# Altium project SCOPE_F07x.PrjPcb
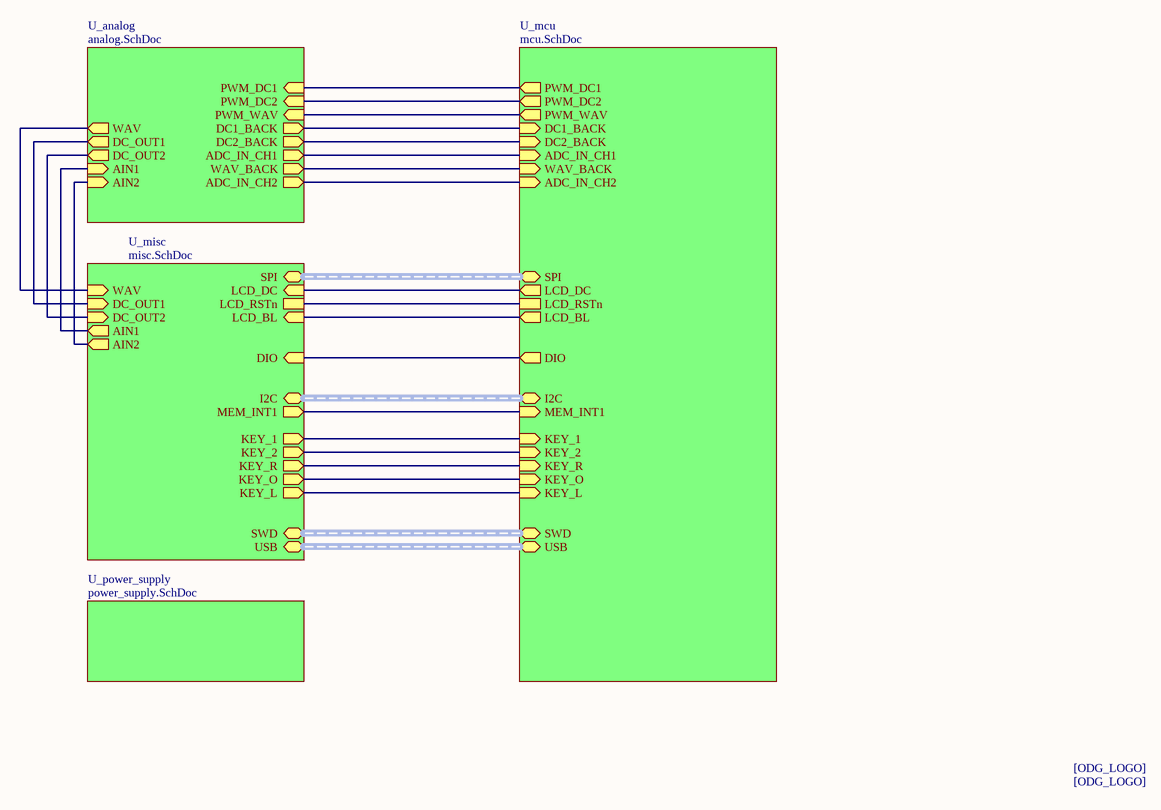
[diagram p0: Scope_top.SchDoc]
5 sheets, 129 parts. Net scope: hierarchical (ports join the sheet entries above them; power ports are global).
Board file: Scope.PcbDoc
Sheets:
  Scope_top.SchDoc
    U_mcu = mcu.SchDoc
    U_power_supply = power_supply.SchDoc
    U_analog = analog.SchDoc
    U_misc = misc.SchDoc

## Sheet Scope_top.SchDoc: SCOPE-F07x: top
size A4; Organization: Draw By: OldGerman; Address2: https://github.com; Address3: /oldgerman/SCOPE-F07x; Revision: v1.1; SheetNumber: 1; SheetTotal: 5

### Parts
ODG1  ODG_LOGO  [ODG_LOGO]  (value not drawn)
ODG2  ODG_LOGO  [ODG_LOGO]  (value not drawn)

### Sub-sheets
U_analog = analog.SchDoc: PWM_WAV (in), DC1_BACK (out), DC2_BACK (out), ADC_IN_CH1 (out), WAV_BACK (out), ADC_IN_CH2 (out), WAV (out), DC_OUT1 (out), DC_OUT2 (out), AIN1 (in), AIN2 (in), PWM_DC2 (in), PWM_DC1 (in)
U_mcu = mcu.SchDoc: PWM_WAV (out), DC1_BACK (in), DC2_BACK (in), ADC_IN_CH1 (in), WAV_BACK (in), ADC_IN_CH2 (in), DIO (out), LCD_DC (out), LCD_RSTn, MEM_INT1 (in), KEY_1 (in), KEY_2 (in), KEY_R (in), KEY_O (in), KEY_L (in), USB (bidir, harness USB), PWM_DC2 (out), PWM_DC1 (out), SWD (bidir, harness SWD), I2C (bidir, harness I2C), LCD_BL (out), SPI (bidir, harness SPI)
U_misc = misc.SchDoc: USB (bidir, harness USB), DIO (in), LCD_DC (in), LCD_RSTn, KEY_1 (out), KEY_2 (out), KEY_R (out), KEY_O (out), KEY_L (out), MEM_INT1 (out), WAV (in), DC_OUT1 (in), DC_OUT2 (in), AIN1 (out), AIN2 (out), SWD (bidir, harness SWD), I2C (bidir, harness I2C), LCD_BL (in), SPI (bidir, harness SPI)
U_power_supply = power_supply.SchDoc: no entries

### Nets
KEY_L: sheet U_mcu/KEY_L, sheet U_misc/KEY_L
KEY_O: sheet U_mcu/KEY_O, sheet U_misc/KEY_O
KEY_R: sheet U_mcu/KEY_R, sheet U_misc/KEY_R
LCD_BL: sheet U_mcu/LCD_BL, sheet U_misc/LCD_BL
LCD_DC: sheet U_mcu/LCD_DC, sheet U_misc/LCD_DC
LCD_RSTn: sheet U_mcu/LCD_RSTn, sheet U_misc/LCD_RSTn
NetC44_1: sheet U_analog/DC_OUT2, sheet U_misc/DC_OUT2
NetC45_1: sheet U_analog/DC_OUT1, sheet U_misc/DC_OUT1
NetP1_4: sheet U_analog/WAV, sheet U_misc/WAV
NetP1_8: sheet U_mcu/DIO, sheet U_misc/DIO
NetP1_10: sheet U_analog/AIN1, sheet U_misc/AIN1
NetP1_12: sheet U_analog/AIN2, sheet U_misc/AIN2
NetR4_1: sheet U_mcu/PWM_WAV, sheet U_analog/PWM_WAV
NetR13_2: sheet U_mcu/ADC_IN_CH1, sheet U_analog/ADC_IN_CH1
NetR18_1: sheet U_mcu/PWM_DC2, sheet U_analog/PWM_DC2
NetR22_1: sheet U_mcu/DC2_BACK, sheet U_analog/DC2_BACK
NetR26_2: sheet U_mcu/ADC_IN_CH2, sheet U_analog/ADC_IN_CH2
NetR32_1: sheet U_mcu/PWM_DC1, sheet U_analog/PWM_DC1
NetR35_1: sheet U_mcu/DC1_BACK, sheet U_analog/DC1_BACK
NetR48_2: sheet U_mcu/WAV_BACK, sheet U_analog/WAV_BACK
NetR49_1: sheet U_mcu/KEY_2, sheet U_misc/KEY_2
NetR50_1: sheet U_mcu/KEY_1, sheet U_misc/KEY_1
NetU2_43: sheet U_mcu/MEM_INT1, sheet U_misc/MEM_INT1

### Buses and harness runs
harness sheet U_mcu/I2C = sheet U_misc/I2C
harness sheet U_mcu/SPI = sheet U_misc/SPI
harness sheet U_mcu/SWD = sheet U_misc/SWD
harness sheet U_mcu/USB = sheet U_misc/USB

### Notes on the sheet
- Title
- Size:
- Date:
- A4
- Number:
- Time:
- Revision:
- Sheet
- of
- File:
- (in symbol ODG_LOGO) [ODG_LOGO]

## Sheet mcu.SchDoc: SCOPE-F07x: mcu
size A4; DrawnBy: OldGerman; Organization: Draw By: OldGerman; Address2: https://github.com; Address3: /oldgerman/SCOPE-F07x; Revision: v1.1; SheetNumber: 3; SheetTotal: 5
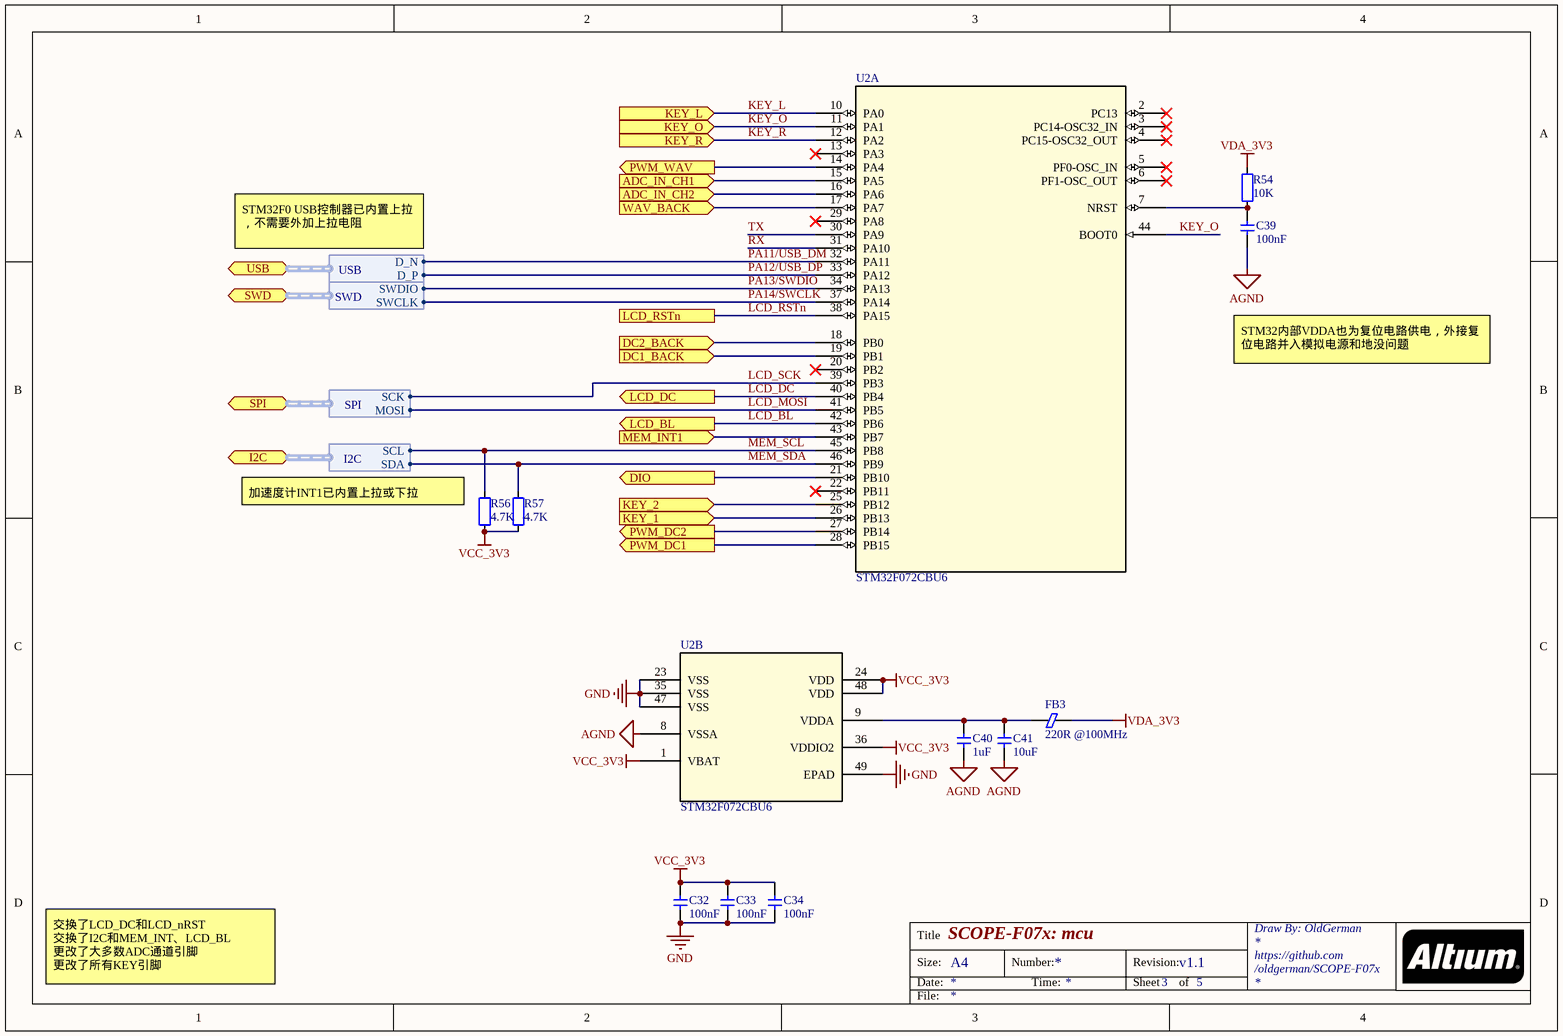
[diagram p1: mcu.SchDoc]

### Parts
C32  100nF  [C0402]
C33  100nF  [C0402]
C34  100nF  [C0402]
C39  100nF  [C0402]
C40  1uF  [C0402]
C41  10uF  [C0402]
FB3  220R @100MHz  [FER0402]
R54  10K  [R0402]
R56  4.7K  [R0402]
R57  4.7K  [R0402]
U2  STM32F072CBU6  [UFQFPN-48_7X7X0P55MM_VIA]  (parts A,B of 2)

### Ports
ADC_IN_CH1 (in), ADC_IN_CH2 (in), DC1_BACK (in), DC2_BACK (in), DIO (out), I2C (bidir, harness I2C), KEY_1 (in), KEY_2 (in), KEY_L (in), KEY_O (in), KEY_R (in), LCD_BL (out), LCD_DC (out), LCD_RSTn, MEM_INT1 (in), PWM_DC1 (out), PWM_DC2 (out), PWM_WAV (out), SPI (bidir, harness SPI), SWD (bidir, harness SWD), USB (bidir, harness USB), WAV_BACK (in)

### Harnesses
USB: D_P, D_N
SWD: SWCLK, SWDIO
I2C: SDA, SCL
SPI: MOSI, SCK

### Nets
AGND: C39.2 C40.2 C41.2 U2.8(VSSA)
GND: C32.2 C33.2 C34.2 U2.23(VSS) U2.35(VSS) U2.47(VSS) U2.49(EPAD)
VCC_3V3: C32.1 C33.1 C34.1 R56.1 R57.1 U2.1(VBAT) U2.24(VDD) U2.36(VDDIO2) U2.48(VDD)
VDA_3V3: FB3.1 R54.1
KEY_L: U2.10(PA0) ; port KEY_L
KEY_O: U2.11(PA1) U2.44(BOOT0) ; port KEY_O
KEY_R: U2.12(PA2) ; port KEY_R
LCD_BL: U2.42(PB6) ; port LCD_BL
LCD_DC: U2.40(PB4) ; port LCD_DC
LCD_MOSI: U2.41(PB5) ; port SPI.MOSI
LCD_RSTn: U2.38(PA15) ; port LCD_RSTn
LCD_SCK: U2.39(PB3) ; port SPI.SCK
MEM_SCL: R56.2 U2.45(PB8) ; port I2C.SCL
MEM_SDA: R57.2 U2.46(PB9) ; port I2C.SDA
PA11/USB_DM: U2.32(PA11) ; port USB.D_N  [project net D-_B7]
PA12/USB_DP: U2.33(PA12) ; port USB.D_P  [project net D+_B6]
PA13/SWDIO: U2.34(PA13) ; port SWD.SWDIO  [project net D-_A7]
PA14/SWCLK: U2.37(PA14) ; port SWD.SWCLK  [project net D+_A6]
RX: U2.31(PA10)
TX: U2.30(PA9)
NetC39_1: C39.1 R54.2 U2.7(NRST)
NetC40_1: C40.1 C41.1 FB3.2 U2.9(VDDA)
NetP1_8: U2.21(PB10) ; port DIO
NetR4_1: U2.14(PA4) ; port PWM_WAV
NetR13_2: U2.15(PA5) ; port ADC_IN_CH1
NetR18_1: U2.27(PB14) ; port PWM_DC2
NetR22_1: U2.18(PB0) ; port DC2_BACK
NetR26_2: U2.16(PA6) ; port ADC_IN_CH2
NetR32_1: U2.28(PB15) ; port PWM_DC1
NetR35_1: U2.19(PB1) ; port DC1_BACK
NetR48_2: U2.17(PA7) ; port WAV_BACK
NetR49_1: U2.25(PB12) ; port KEY_2
NetR50_1: U2.26(PB13) ; port KEY_1
NetU2_43: U2.43(PB7) ; port MEM_INT1

Not connected (* = marked no-connect by the designer): U2 2(PC13)* 3(PC14-OSC32_IN)* 4(PC15-OSC32_OUT)* 5(PF0-OSC_IN)* 6(PF1-OSC_OUT)* 13(PA3)* 20(PB2)* 22(PB11)* 29(PA8)*

### Notes on the sheet
- STM32F0 USB控制器已内置上拉，不需要外加上拉电阻
- STM32内部VDDA也为复位电路供电，外接复位电路并入模拟电源和地没问题
- (near R56) 加速度计INT1已内置上拉或下拉
- 交换了LCD_DC和LCD_nRST
  交换了I2C和MEM_INT、LCD_BL
  更改了大多数ADC通道引脚
  更改了所有KEY引脚
- Title
- Size:
- Date:
- A4
- Number:
- Time:
- Revision:
- Sheet
- of
- File:

### Library data of the parts
C32-C34 C39-C41 = CAP: Capacitor; Value: 0.1u
FB3 = Ferrite: 磁珠
R54 R56 R57 = RES: Resistor; Value: 22R
U2 = STM32F072CBU6: Mainstream Arm Cortex-M0 USB line MCU with 128 Kbytes of Flash memory, 48 MHz CPU, USB, CAN and CEC functions; Mfr_Name: STMicroelectronics; Copyright: Copyright (C) 2022 Ultra Librarian. All rights reserved.; Manufacturer_Part_Number: STM32F072CBU6; RefDes: RefDes; Type: DEV

## Sheet power_supply.SchDoc: SCOPE-F07x: power_supply
size A4; Organization: Draw By: OldGerman; Address2: https://github.com; Address3: /oldgerman/SCOPE-F07x; Revision: v1.1; SheetNumber: 4; SheetTotal: 5
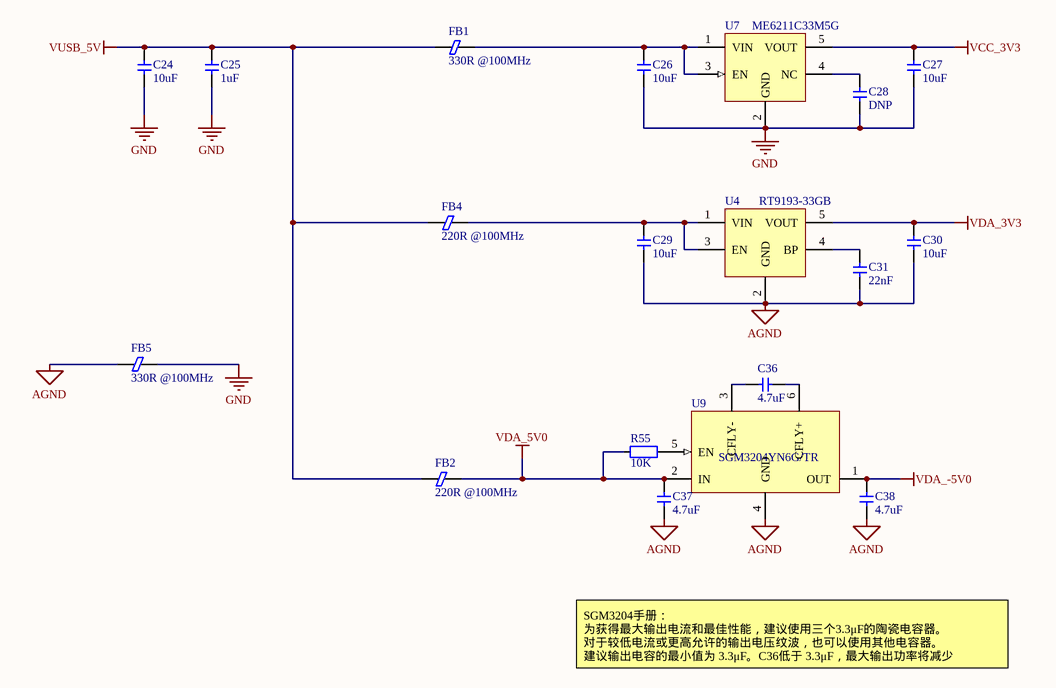
[diagram p2: power_supply.SchDoc]

### Parts
C24  10uF  [C0402]
C25  1uF  [C0402]
C26  10uF  [C0402]
C27  10uF  [C0402]
C28  DNP  [C0402]
C29  10uF  [C0402]
C30  10uF  [C0402]
C31  22nF  [C0402]
C36  4.7uF  [C0402]
C37  4.7uF  [C0402]
C38  4.7uF  [C0402]
FB1  330R @100MHz  [FER0603]
FB2  220R @100MHz  [FER0402]
FB4  220R @100MHz  [FER0402]
FB5  330R @100MHz  [FER0603]
R55  10K  [R0402]
U4  RT9193-33GB  [MICROCHIP SOT-23-5 OT]
U7  ME6211C33M5G  [ANALOG TSOT-23-5 UJ-5]
U9  SGM3204YN6G/TR  [MICROCHIP SOT-23-6 M6]

### Nets
AGND: C29.2 C30.2 C31.2 C37.2 C38.2 FB5.2 U4.2(GND) U9.4(GND)
GND: C24.2 C25.2 C26.2 C27.2 C28.2 FB5.1 U7.2(GND)
VCC_3V3: C27.1 U7.5(VOUT)
VDA_3V3: C30.1 U4.5(VOUT)
VDA_5V0: C37.1 FB2.1 R55.2 U9.2(IN)
VDA_-5V0: C38.1 U9.1(OUT)
VUSB_5V: C24.1 C25.1 FB1.1 FB2.2 FB4.1
NetC26_1: C26.1 FB1.2 U7.1(VIN) U7.3(EN)
NetC28_1: C28.1 U7.4(NC)
NetC29_1: C29.1 FB4.2 U4.1(VIN) U4.3(EN)
NetC31_1: C31.1 U4.4(BP)
NetC36_1: C36.1 U9.3(CFLY-)
NetC36_2: C36.2 U9.6(CFLY+)
NetR55_1: R55.1 U9.5(EN)

### Notes on the sheet
- SGM3204手册：
  为获得最大输出电流和最佳性能，建议使用三个3.3μF的陶瓷电容器。
  对于较低电流或更高允许的输出电压纹波，也可以使用其他电容器。
  建议输出电容的最小值为 3.3μF。C36低于 3.3μF，最大输出功率将减少
- Title
- Size:
- Date:
- A4
- Number:
- Time:
- Revision:
- Sheet
- of
- File:

### Library data of the parts
C24-C31 C36-C38 = CAP: Capacitor; Value: 0.1u
FB1 FB2 FB4 FB5 = Ferrite: 磁珠
R55 = RES: Resistor; Value: 22R
U4 = LP2992: LDO
U7 = ME6211C33M5G: 线性稳压芯片; BOM名称: 可调升压芯片; 版权归属: 源创客; 学习资源: www.ooocke.com
U9 = SGM3204YN6G/TR: Unregulated 200mA / Charge Pump Voltage Inverter / 1.4-5.5V to -1.4-5.5V; BOM名称: 可调升压芯片; 版权归属: 源创客; 学习资源: www.ooocke.com

## Sheet analog.SchDoc: SCOPE-F07x: analog
size A4; Organization: Draw By: OldGerman; Address2: https://github.com; Address3: /oldgerman/SCOPE-F07x; Revision: v1.1; SheetNumber: 2; SheetTotal: 5
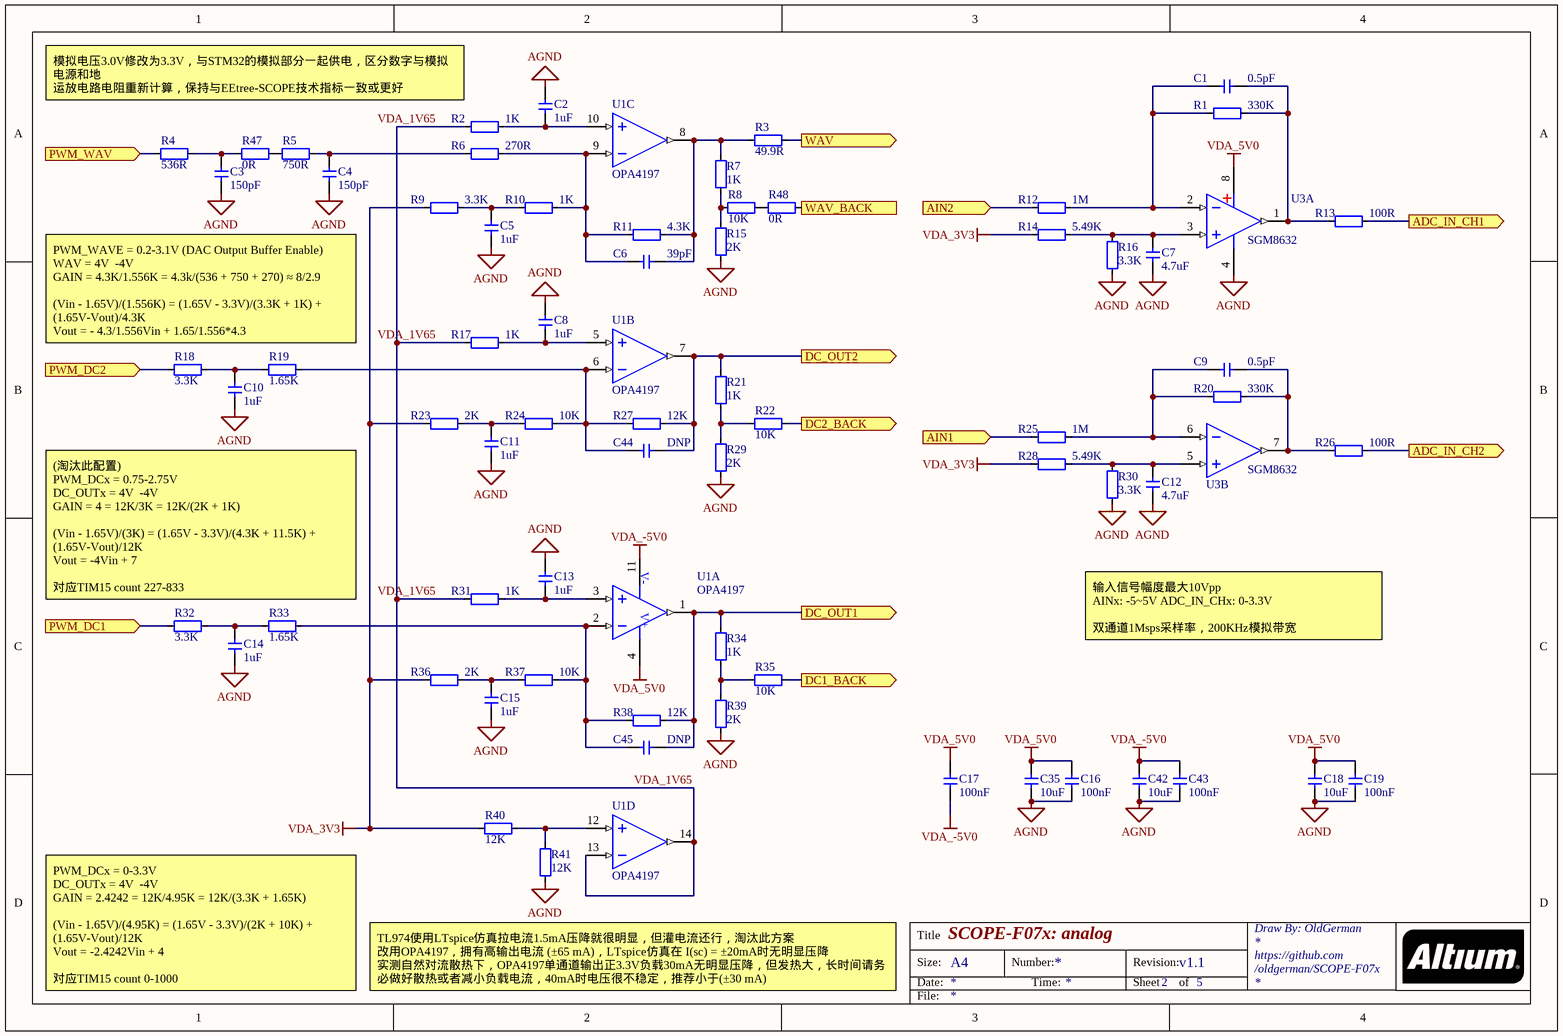
[diagram p3: analog.SchDoc]

### Parts
C1  0.5pF  [C0402]
C2  1uF  [C0402]
C3  150pF  [C0402]
C4  150pF  [C0402]
C5  1uF  [C0402]
C6  39pF  [C0402]
C7  4.7uF  [C0402]
C8  1uF  [C0402]
C9  0.5pF  [C0402]
C10  1uF  [C0402]
C11  1uF  [C0402]
C12  4.7uF  [C0402]
C13  1uF  [C0402]
C14  1uF  [C0402]
C15  1uF  [C0402]
C16  100nF  [C0402]
C17  100nF  [C0402]
C18  10uF  [C0402]
C19  100nF  [C0402]
C35  10uF  [C0402]
C42  10uF  [C0402]
C43  100nF  [C0402]
C44  DNP  [C0402]
C45  DNP  [C0402]
R1  330K  [R0402]
R2  1K  [R0402]
R3  49.9R  [R0402]
R4  536R  [R0402]
R5  750R  [R0402]
R6  270R  [R0402]
R7  1K  [R0402]
R8  10K  [R0402]
R9  3.3K  [R0402]
R10  1K  [R0402]
R11  4.3K  [R0402]
R12  1M  [R0402]
R13  100R  [R0402]
R14  5.49K  [R0402]
R15  2K  [R0402]
R16  3.3K  [R0402]
R17  1K  [R0402]
R18  3.3K  [R0402]
R19  1.65K  [R0402]
R20  330K  [R0402]
R21  1K  [R0402]
R22  10K  [R0402]
R23  2K  [R0402]
R24  10K  [R0402]
R25  1M  [R0402]
R26  100R  [R0402]
R27  12K  [R0402]
R28  5.49K  [R0402]
R29  2K  [R0402]
R30  3.3K  [R0402]
R31  1K  [R0402]
R32  3.3K  [R0402]
R33  1.65K  [R0402]
R34  1K  [R0402]
R35  10K  [R0402]
R36  2K  [R0402]
R37  10K  [R0402]
R38  12K  [R0402]
R39  2K  [R0402]
R40  12K  [R0402]
R41  12K  [R0402]
R47  0R  [R0805]
R48  0R  [R0805]
U1  OPA4197  [ON SEMI TSSOP-14 948G]  (parts A,B,C,D of 4)
U3  SGM8632  [ANALOG DEV SOIC-8 R8]  (parts A,B of 2)

### Ports
ADC_IN_CH1 (out), ADC_IN_CH2 (out), AIN1 (in), AIN2 (in), DC1_BACK (out), DC2_BACK (out), DC_OUT1 (out), DC_OUT2 (out), PWM_DC1 (in), PWM_DC2 (in), PWM_WAV (in), WAV (out), WAV_BACK (out)

### Nets
AGND: C2.2 C3.1 C4.1 C5.1 C7.1 C8.2 C10.1 C11.1 C12.1 C13.2 C14.1 C15.1 C16.1 C18.1 C19.1 C35.1 C42.1 C43.1 R15.1 R16.1 R29.1 R30.1 R39.1 R41.1 U3.4(V-)
VDA_3V3: R9.1 R14.1 R23.1 R28.1 R36.1 R40.1
VDA_5V0: C16.2 C17.2 C18.2 C19.2 C35.2 U1.4(VDD) U3.8(V+)
VDA_-5V0: C17.1 C42.2 C43.2 U1.11(VSS)
VDA_1V65: R2.1 R17.1 R31.1 U1.13(IN_D-) U1.14(OUTD)
NetC1_1: C1.1 R1.2 R13.1 U3.1(OUT1)
NetC1_2: C1.2 R1.1 R12.2 U3.2(-)
NetC2_1: C2.1 R2.2 U1.10(IN_C+)
NetC3_2: C3.2 R4.2 R47.1
NetC4_2: C4.2 R5.2 R6.1
NetC5_2: C5.2 R9.2 R10.1
NetC6_1: C6.1 R3.1 R7.2 R11.2 U1.8(OUTC)
NetC6_2: C6.2 R6.2 R10.2 R11.1 U1.9(IN_C-)
NetC7_2: C7.2 R14.2 R16.2 U3.3(+)
NetC8_1: C8.1 R17.2 U1.5(IN_B+)
NetC9_1: C9.1 R20.2 R26.1 U3.7(OUT2)
NetC9_2: C9.2 R20.1 R25.2 U3.6(-)
NetC10_2: C10.2 R18.2 R19.1
NetC11_2: C11.2 R23.2 R24.1
NetC12_2: C12.2 R28.2 R30.2 U3.5(+)
NetC13_1: C13.1 R31.2 U1.3(IN_A+)
NetC14_2: C14.2 R32.2 R33.1
NetC15_2: C15.2 R36.2 R37.1
NetC44_1: C44.1 R21.2 R27.2 U1.7(OUTB) ; port DC_OUT2
NetC44_2: C44.2 R19.2 R24.2 R27.1 U1.6(IN_B-)
NetC45_1: C45.1 R34.2 R38.2 U1.1(OUTA) ; port DC_OUT1
NetC45_2: C45.2 R33.2 R37.2 R38.1 U1.2(IN_A-)
NetP1_4: R3.2 ; port WAV
NetP1_10: R25.1 ; port AIN1
NetP1_12: R12.1 ; port AIN2
NetR4_1: R4.1 ; port PWM_WAV
NetR5_1: R5.1 R47.2
NetR7_1: R7.1 R8.2 R15.2
NetR8_1: R8.1 R48.1
NetR13_2: R13.2 ; port ADC_IN_CH1
NetR18_1: R18.1 ; port PWM_DC2
NetR21_1: R21.1 R22.2 R29.2
NetR22_1: R22.1 ; port DC2_BACK
NetR26_2: R26.2 ; port ADC_IN_CH2
NetR32_1: R32.1 ; port PWM_DC1
NetR34_1: R34.1 R35.2 R39.2
NetR35_1: R35.1 ; port DC1_BACK
NetR40_2: R40.2 R41.2 U1.12(IN_D+)
NetR48_2: R48.2 ; port WAV_BACK

### Notes on the sheet
- (near R2) 模拟电压3.0V修改为3.3V，与STM32的模拟部分一起供电，区分数字与模拟电源和地
  运放电路电阻重新计算，保持与EEtree-SCOPE技术指标一致或更好
- PWM_WAVE = 0.2-3.1V (DAC Output Buffer Enable)
  WAV = 4V  -4V
  GAIN = 4.3K/1.556K = 4.3k/(536 + 750 + 270) ≈ 8/2.9
  (Vin - 1.65V)/(1.556K) = (1.65V - 3.3V)/(3.3K + 1K) + (1.65V-Vout)/4.3K
  Vout = - 4.3/1.556Vin + 1.65/1.556*4.3
- (淘汰此配置)
  PWM_DCx = 0.75-2.75V
  DC_OUTx = 4V  -4V
  GAIN = 4 = 12K/3K = 12K/(2K + 1K)
  (Vin - 1.65V)/(3K) = (1.65V - 3.3V)/(4.3K + 11.5K) + (1.65V-Vout)/12K
  Vout = -4Vin + 7
  对应TIM15 count 227-833
- 输入信号幅度最大10Vpp
  AINx: -5~5V ADC_IN_CHx: 0-3.3V
  双通道1Msps采样率，200KHz模拟带宽
- PWM_DCx = 0-3.3V
  DC_OUTx = 4V  -4V
  GAIN = 2.4242 = 12K/4.95K = 12K/(3.3K + 1.65K)
  (Vin - 1.65V)/(4.95K) = (1.65V - 3.3V)/(2K + 10K) + (1.65V-Vout)/12K
  Vout = -2.4242Vin + 4
  对应TIM15 count 0-1000
- TL974使用LTspice仿真拉电流1.5mA压降就很明显，但灌电流还行，淘汰此方案
  改用OPA4197，拥有高输出电流 (±65 mA)，LTspice仿真在 I(sc) = ±20mA时无明显压降
  实测自然对流散热下，OPA4197单通道输出正3.3V负载30mA无明显压降，但发热大，长时间请务必做好散热或者减小负载电流，40mA时电压很不稳定，推荐小于(±30 mA)
- Title
- Size:
- Date:
- A4
- Number:
- Time:
- Revision:
- Sheet
- of
- File:
- (in symbol OPA4140AIPWR, part A) V-; V+

### Library data of the parts
C1-C19 C35 C42-C45 = CAP: Capacitor; Value: 0.1u
R1-R41 R47 R48 = RES: Resistor; Value: 22R
U1 = OPA4140AIPWR: Part Number: ADA4622-4; Manufacturer: Analog Devices; Manufacturer Part Number: ADA4622-4ACPZ-RL; Part number IPS: 00000004963; Value: ADA4622; Artikkelnr Noca: N.A.; Pad Count: 17; ComponentLink1URL: https://www.analog.com/media/en/technical-documentation/data-sheets/ada4622-1-4622-2-4622-4.pdf; ComponentLink1Description: Datasheet; ComponentLink2URL: https://www.digikey.no/product-detail/en/analog-devices-inc/ADA4622-4ACPZ-RL/ADA4622-4ACPZ-RL-ND/6490586; ComponentLink2Description: Supplier link; HelpURL: https://www.analog.com/en/products/ada4622-4.html; Footprint Doc: QFN-16; LatestRevisionDate: 2019-06-19; Pin Count: 17; Publisher: Nordic Semiconductor; Published: 2019-06-19; Supplier 1: Digi-Key; Supplier Part Number 1: ADA4622-4ACPZ-R7-ND; Supplier 2: Mouser; Supplier Part Number 2: 584-ADA4622-4ACPZ-R7; Component Class: Misc_ICs; PartId: 101900585
U3 = AD8542: BOM名称: 双运放; 版权归属: 源创客; 学习资源: www.ooocke.com; ComponentLink1Description: 中文数据手册; ComponentLink1URL: https://www.analog.com/media/cn/technical-documentation/data-sheets/AD8541_8542_8544_cn.pdf; ComponentLink2Description: Data Sheet; ComponentLink2URL: https://www.analog.com/media/en/technical-documentation/data-sheets/AD8541_8542_8544.pdf

## Sheet misc.SchDoc: SCOPE-F07x: misc
size A4; Organization: Draw By: OldGerman; Address2: https://github.com; Address3: /oldgerman/SCOPE-F07x; Revision: v1.1; SheetNumber: 5; SheetTotal: 5
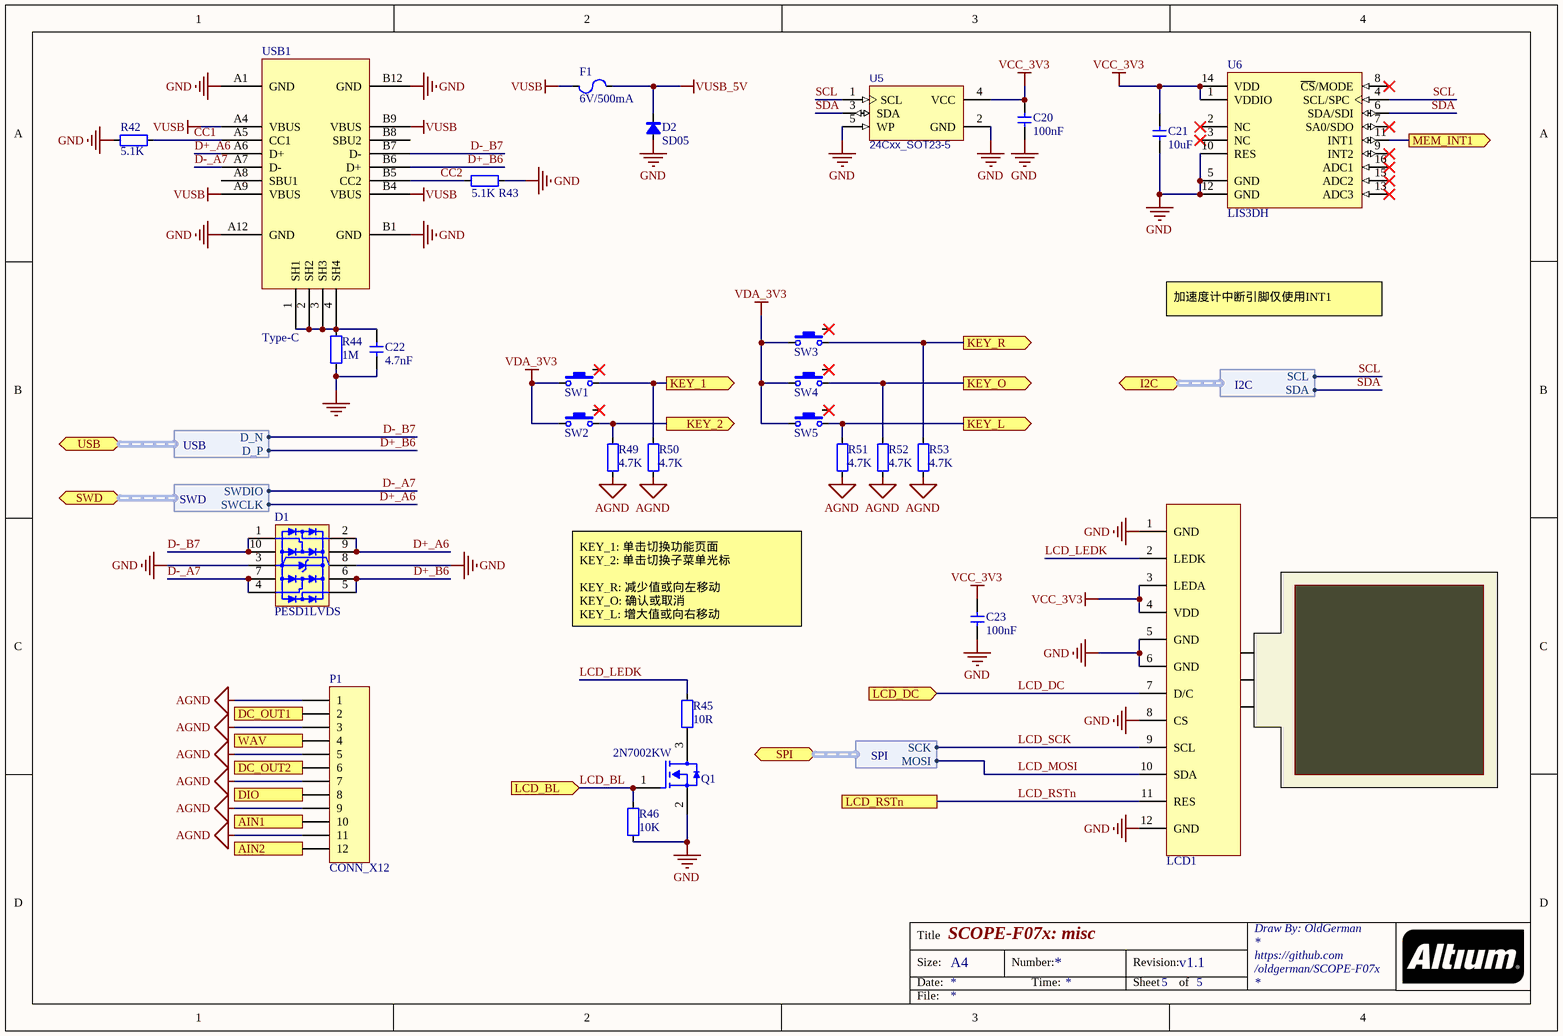
[diagram p4: misc.SchDoc]

### Parts
C20  100nF  [C0402]
C21  10uF  [C0402]
C22  4.7nF  [C0402]
C23  100nF  [C0402]
D1  PESD1LVDS  [DFN2510-10_SOT1165-1]
D2  SD05  [SOD-323]
F1  6V/500mA  [FUSE0603_0.5MM]
LCD1  LCD_240x240  [LCD-240X240-1.54INCH_FLUSH_FRONT]  (value not drawn)
P1  CONN_X12  [2.54MM_FEMALE_1x12_180H]
Q1  2N7002KW  [DIODES SOT-323-3]
R42  5.1K  [R0402]
R43  5.1K  [R0402]
R44  1M  [R0402]
R45  10R  [R0603]
R46  10K  [R0402]
R49  4.7K  [R0402]
R50  4.7K  [R0402]
R51  4.7K  [R0402]
R52  4.7K  [R0402]
R53  4.7K  [R0402]
SW1  Button-2P+PAD  [TACTILE_SWITCH_SMD_4.6x1.82x3.5mm_1TS003B]  (value not drawn)
SW2  Button-2P+PAD  [TACTILE_SWITCH_SMD_4.6x1.82x3.5mm_1TS003B]  (value not drawn)
SW3  Button-2P+PAD  [TACTILE_SWITCH_SMD_4.6x1.82x3.5mm_1TS003B]  (value not drawn)
SW4  Button-2P+PAD  [TACTILE_SWITCH_SMD_4.6x1.82x3.5mm_1TS003B]  (value not drawn)
SW5  Button-2P+PAD  [TACTILE_SWITCH_SMD_4.6x1.82x3.5mm_1TS003B]  (value not drawn)
U5  24Cxx_SOT23-5  [MICROCHIP SOT-23-5 OT]
U6  LIS3DH  [LGA-16-3X3]
USB1  Type-C  [Type-C-TOP]

### Ports
AIN1 (out), AIN2 (out), DC_OUT1 (in), DC_OUT2 (in), DIO (in), I2C (bidir, harness I2C), KEY_1 (out), KEY_2 (out), KEY_L (out), KEY_O (out), KEY_R (out), LCD_BL (in), LCD_DC (in), LCD_RSTn, MEM_INT1 (out), SPI (bidir, harness SPI), SWD (bidir, harness SWD), USB (bidir, harness USB), WAV (in)

### Harnesses
USB: D_P, D_N
SWD: SWCLK, SWDIO
I2C: SDA, SCL
SPI: MOSI, SCK

### Nets
AGND: P1.1 P1.3 P1.5 P1.7 P1.9 P1.11 R49.2 R50.2 R51.2 R52.2 R53.2
GND: C20.2 C21.2 C22.2 C23.1 D1.3(GND) D1.8(GND) D2.1(A) LCD1.1(GND) LCD1.5(GND) LCD1.6(GND) LCD1.8(CS) LCD1.12(GND) Q1.2(S) R42.2 R43.1 R44.2 R46.1 U5.2(GND) U5.5(WP) U6.5(GND) U6.10(RES) U6.12(GND) USB1.A1(GND) USB1.A12(GND) USB1.B1(GND) USB1.B12(GND)
VCC_3V3: C20.1 C21.1 C23.2 LCD1.3(LEDA) LCD1.4(VDD) U5.4(VCC) U6.1(VDDIO) U6.14(VDD)
VDA_3V3: SW1.1 SW2.1 SW3.1 SW4.1 SW5.1
VUSB: F1.1 USB1.A4(VBUS) USB1.A9(VBUS) USB1.B4(VBUS) USB1.B9(VBUS)
VUSB_5V: D2.2(C) F1.2
CC1: R42.1 USB1.A5(CC1)
CC2: R43.2 USB1.B5(CC2)
D+_A6: D1.2(I/O) D1.9(GND) USB1.A6(D+) ; port SWD.SWCLK
D+_B6: D1.5(I/O) D1.6(GND) USB1.B6(D+) ; port USB.D_P
D-_A7: D1.4(I/O) D1.7(GND) USB1.A7(D-) ; port SWD.SWDIO
D-_B7: D1.1(I/O) D1.10(GND) USB1.B7(D-) ; port USB.D_N
KEY_L: R51.1 SW5.2 ; port KEY_L
KEY_O: R52.1 SW4.2 ; port KEY_O
KEY_R: R53.1 SW3.2 ; port KEY_R
LCD_BL: Q1.1(G) R46.2 ; port LCD_BL
LCD_DC: LCD1.7(D/C) ; port LCD_DC
LCD_LEDK: LCD1.2(LEDK) R45.2
LCD_MOSI: LCD1.10(SDA) ; port SPI.MOSI
LCD_RSTn: LCD1.11(RES) ; port LCD_RSTn
LCD_SCK: LCD1.9(SCL) ; port SPI.SCK
SCL: U5.1(SCL) U6.4(SCL/SPC) ; port I2C.SCL  [project net MEM_SCL]
SDA: U5.3(SDA) U6.6(SDA/SDI) ; port I2C.SDA  [project net MEM_SDA]
NetC22_1: C22.1 R44.1 USB1.1(SH1) USB1.2(SH2) USB1.3(SH3) USB1.4(SH4)
NetC44_1: P1.6 ; port DC_OUT2
NetC45_1: P1.2 ; port DC_OUT1
NetP1_4: P1.4 ; port WAV
NetP1_8: P1.8 ; port DIO
NetP1_10: P1.10 ; port AIN1
NetP1_12: P1.12 ; port AIN2
NetQ1_3: Q1.3(D) R45.1
NetR49_1: R49.1 SW2.2 ; port KEY_2
NetR50_1: R50.1 SW1.2 ; port KEY_1
NetU2_43: U6.11(INT1) ; port MEM_INT1

Not connected (* = marked no-connect by the designer): SW1 3*; SW2 3*; SW3 3*; SW4 3*; SW5 3*; U6 2(NC)* 3(NC)* 7(SA0/SDO)* 8(~{CS}/MODE)* 9(INT2)* 13(ADC3)* 15(ADC2)* 16(ADC1)*; USB1 A8(SBU1) B8(SBU2)

### Notes on the sheet
- 加速度计中断引脚仅使用INT1
- KEY_1: 单击切换功能页面
  KEY_2: 单击切换子菜单光标
  KEY_R: 减少值或向左移动
  KEY_O: 确认或取消
  KEY_L: 增大值或向右移动
- Title
- Size:
- Date:
- A4
- Number:
- Time:
- Revision:
- Sheet
- of
- File:

### Library data of the parts
C20-C23 = CAP: Capacitor; Value: 0.1u
D1 = PESD1LVDS: Ultra-Low Capacitance TVS Protection; BOM名称: 钳位IC; 版权归属: 源创客; 属性: 30V/0.2A; 学习资源: www.ooocke.com
D2 = DIODE: 单向 5V TVS
F1 = FUSE: 贴片自恢复保险丝
Q1 = N-MOS_123: N-MOS
R42-R46 R49-R53 = RES: Resistor; Value: 22R
SW1-SW5 = Button-2P+PAD: Button
U6 = LIS3DH: The LIS3DH is an ultra-low-power highperformance three-axis linear accelerometer belonging to the “nano” family, with digital I2C/SPI serial interface standard output. The device features ultra-low-power operational modes that allow advanced power saving and smart embedded functions.; ComponentLink1Description: Datasheet; ComponentLink1URL: https://www.bosch-sensortec.com/media/boschsensortec/downloads/datasheets/bst-bmi160-ds000.pdf
USB1 = USB-Type-C_16P

## Nets that join several sheets
AGND: mcu (C39.2 C40.2 C41.2 U2.8), power_supply (8 pins), analog (25 pins), misc (11 pins)
GND: mcu (7 pins), power_supply (7 pins), misc (26 pins)
VCC_3V3: mcu (9 pins), power_supply (C27.1 U7.5), misc (8 pins)
VDA_3V3: mcu (FB3.1 R54.1), power_supply (C30.1 U4.5), analog (6 pins), misc (5 pins)
VDA_5V0: power_supply (C37.1 FB2.1 R55.2 U9.2), analog (7 pins)
VDA_-5V0: power_supply (C38.1 U9.1), analog (C17.1 C42.2 C43.2 U1.11)
VUSB_5V: power_supply (5 pins), misc (D2.2 F1.2)
D+_A6: mcu (U2.37), misc (D1.2 D1.9 USB1.A6)
D+_B6: mcu (U2.33), misc (D1.5 D1.6 USB1.B6)
D-_A7: mcu (U2.34), misc (D1.4 D1.7 USB1.A7)
D-_B7: mcu (U2.32), misc (D1.1 D1.10 USB1.B7)
KEY_L: mcu (U2.10), misc (R51.1 SW5.2)
KEY_O: mcu (U2.11 U2.44), misc (R52.1 SW4.2)
KEY_R: mcu (U2.12), misc (R53.1 SW3.2)
LCD_BL: mcu (U2.42), misc (Q1.1 R46.2)
LCD_DC: mcu (U2.40), misc (LCD1.7)
LCD_MOSI: mcu (U2.41), misc (LCD1.10)
LCD_RSTn: mcu (U2.38), misc (LCD1.11)
LCD_SCK: mcu (U2.39), misc (LCD1.9)
MEM_SCL: mcu (R56.2 U2.45), misc (U5.1 U6.4)
MEM_SDA: mcu (R57.2 U2.46), misc (U5.3 U6.6)
NetC44_1: analog (C44.1 R21.2 R27.2 U1.7), misc (P1.6)
NetC45_1: analog (C45.1 R34.2 R38.2 U1.1), misc (P1.2)
NetP1_4: analog (R3.2), misc (P1.4)
NetP1_8: mcu (U2.21), misc (P1.8)
NetP1_10: analog (R25.1), misc (P1.10)
NetP1_12: analog (R12.1), misc (P1.12)
NetR4_1: mcu (U2.14), analog (R4.1)
NetR13_2: mcu (U2.15), analog (R13.2)
NetR18_1: mcu (U2.27), analog (R18.1)
NetR22_1: mcu (U2.18), analog (R22.1)
NetR26_2: mcu (U2.16), analog (R26.2)
NetR32_1: mcu (U2.28), analog (R32.1)
NetR35_1: mcu (U2.19), analog (R35.1)
NetR48_2: mcu (U2.17), analog (R48.2)
NetR49_1: mcu (U2.25), misc (R49.1 SW2.2)
NetR50_1: mcu (U2.26), misc (R50.1 SW1.2)
NetU2_43: mcu (U2.43), misc (U6.11)